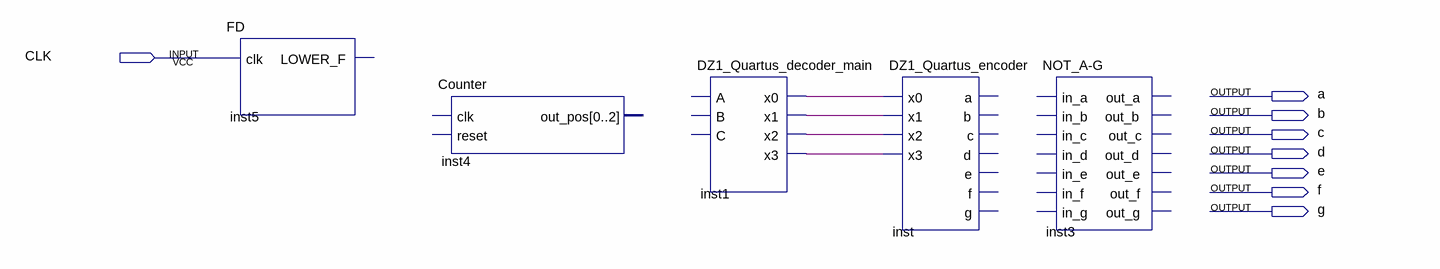
[diagram p0: schematic sheet]
// Quartus schematic DZ1_Quartus_main.bdf as structural Verilog: 5 symbols, 8 pins
module DZ1_Quartus_main (
  input  CLK,
  output a,
  output b,
  output c,
  output d,
  output e,
  output f,
  output g
);

  wire inst1_x0, inst1_x1, inst1_x2, inst1_x3;

  FD inst5 (.clk(CLK));  // open: LOWER_F
  Counter inst4 ();  // open: clk, reset, out_pos
  DZ1_Quartus_decoder_main inst1 (.x0(inst1_x0), .x1(inst1_x1), .x2(inst1_x2), .x3(inst1_x3));  // open: A, B, C
  DZ1_Quartus_encoder inst (.x0(inst1_x0), .x1(inst1_x1), .x2(inst1_x2), .x3(inst1_x3));  // open: a, b, c, d, e, f, g
  \NOT_A-G  inst3 ();  // open: in_a, in_b, in_c, in_d, in_e, in_f, in_g, out_a, out_b, out_c, out_d, out_e, out_f, out_g
endmodule
